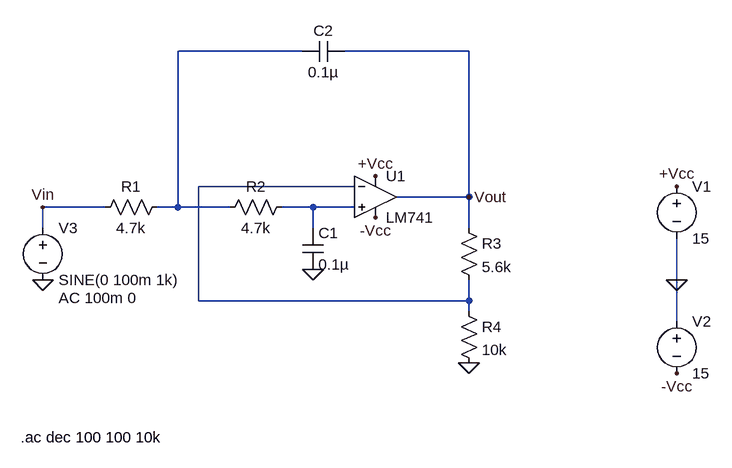
[diagram p0: schematic LPF.asc]
LPF.asc, the LTspice schematic file:
Version 4
SHEET 1 880 680
WIRE -128 -160 -320 -160
WIRE 128 -160 -64 -160
WIRE -48 48 -288 48
WIRE 128 64 128 -160
WIRE 128 64 16 64
WIRE -432 80 -528 80
WIRE -320 80 -320 -160
WIRE -320 80 -352 80
WIRE -240 80 -320 80
WIRE -112 80 -160 80
WIRE -48 80 -112 80
WIRE -528 112 -528 80
WIRE -112 112 -112 80
WIRE 128 112 128 64
WIRE 448 192 448 128
WIRE -288 224 -288 48
WIRE 128 224 128 192
WIRE 128 224 -288 224
WIRE 128 240 128 224
WIRE 448 256 448 192
FLAG 448 192 0
FLAG 448 48 +Vcc
FLAG 448 336 -Vcc
FLAG -528 192 0
FLAG -112 176 0
FLAG 128 320 0
FLAG -16 32 +Vcc
FLAG -16 96 -Vcc
FLAG 128 64 Vout
FLAG -528 80 Vin
SYMBOL voltage 448 32 R0
WINDOW 123 0 0 Left 0
WINDOW 39 0 0 Left 0
SYMATTR InstName V1
SYMATTR Value 15
SYMBOL voltage 448 240 R0
WINDOW 123 0 0 Left 0
WINDOW 39 0 0 Left 0
SYMATTR InstName V2
SYMATTR Value 15
SYMBOL voltage -528 96 R0
WINDOW 123 24 124 Left 2
WINDOW 39 0 0 Left 0
SYMATTR InstName V3
SYMATTR Value SINE(0 100m 1k)
SYMATTR Value2 AC 100m 0
SYMBOL res -336 64 R90
WINDOW 0 0 56 VBottom 2
WINDOW 3 32 56 VTop 2
SYMATTR InstName R1
SYMATTR Value 4.7k
SYMBOL res -144 64 R90
WINDOW 0 0 56 VBottom 2
WINDOW 3 32 56 VTop 2
SYMATTR InstName R2
SYMATTR Value 4.7k
SYMBOL cap -128 112 R0
SYMATTR InstName C1
SYMATTR Value 0.1µ
SYMBOL res 112 96 R0
SYMATTR InstName R3
SYMATTR Value 5.6k
SYMBOL res 112 224 R0
SYMATTR InstName R4
SYMATTR Value 10k
SYMBOL OpAmps\\LM741 -16 0 R0
SYMATTR InstName U1
SYMBOL cap -64 -176 R90
WINDOW 0 0 32 VBottom 2
WINDOW 3 32 32 VTop 2
SYMATTR InstName C2
SYMATTR Value 0.1µ
TEXT -562 434 Left 2 !.ac dec 100 100 10k

The netlist it stands for:
* LPF.asc
V1 +Vcc 0 15
V2 0 -Vcc 15
V3 Vin 0 SINE(0 100m 1k) AC 100m 0
R1 N001 Vin 4.7k
R2 N003 N001 4.7k
C1 N003 0 0.1µ
R3 Vout N002 5.6k
R4 N002 0 10k
XU1 N003 N002 +Vcc -Vcc Vout LM741  ; pins In+ In- V+ V- OUT
C2 Vout N001 0.1µ
.ac dec 100 100 10k
.lib LM741.lib
.backanno
.end